# Altium schematic sheet sine_wave_generator.SchDoc
size A4
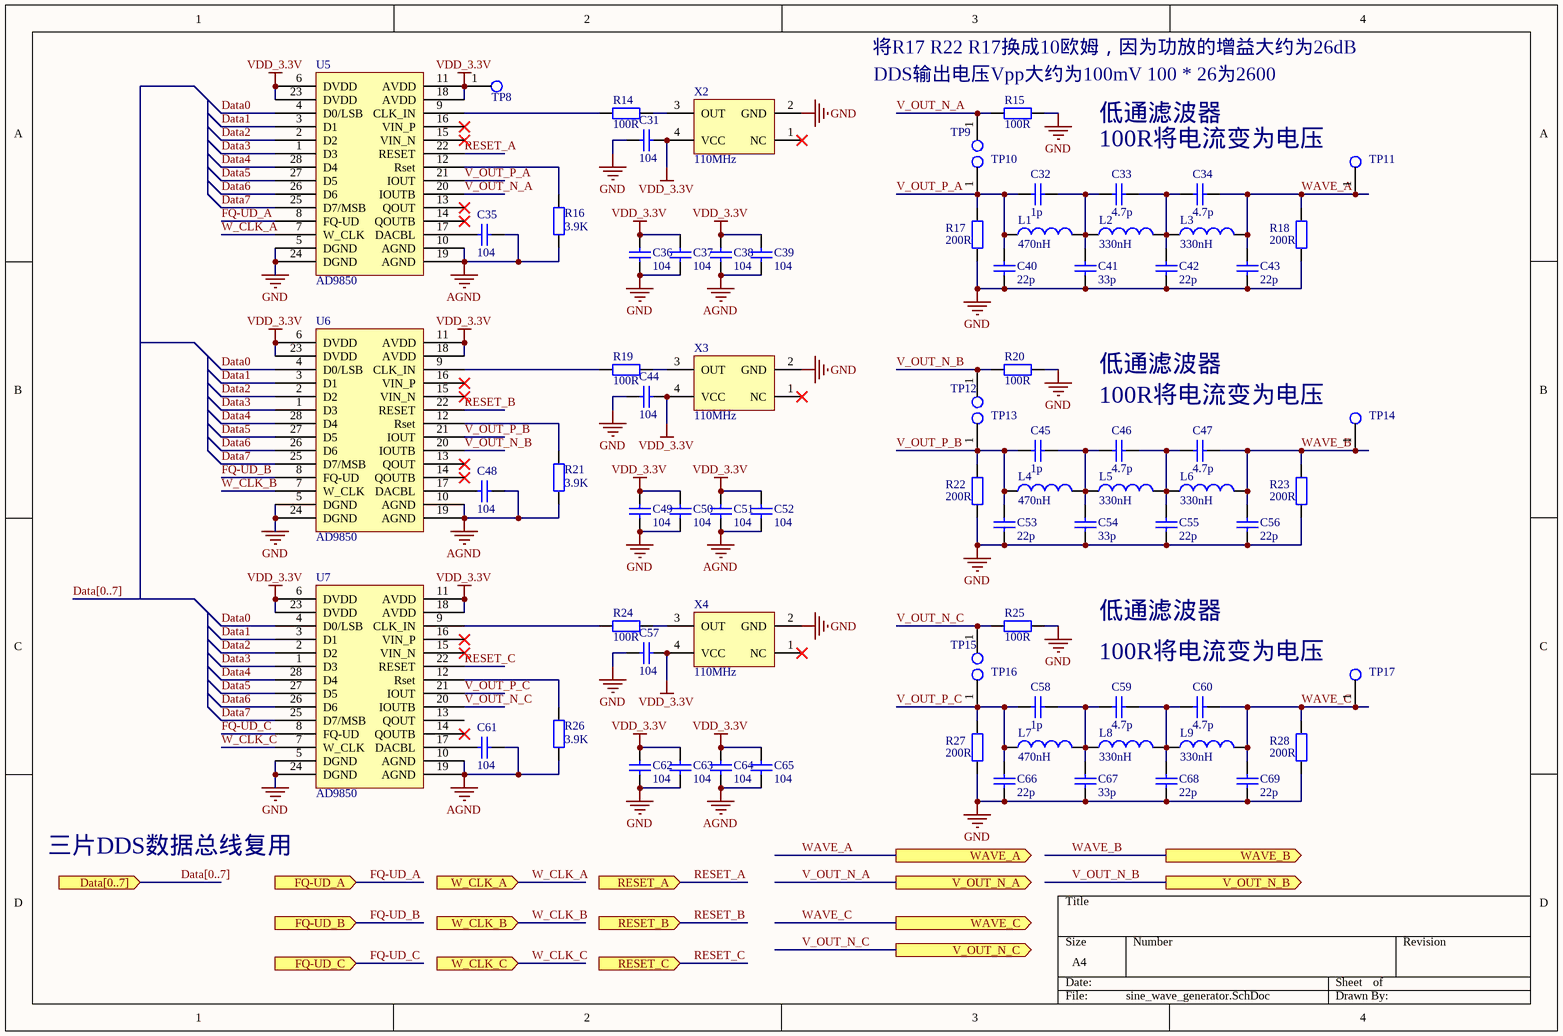
[diagram p0: sine_wave_generator.SchDoc]

## Parts
C31  value 104  [0603]  (hidden comment: Cap)
C32  value 1p  [0603]  (hidden comment: Cap)
C33  value 4.7p  [0603]  (hidden comment: Cap)
C34  value 4.7p  [0603]  (hidden comment: Cap)
C35  value 104  [0603]  (hidden comment: Cap)
C36  value 104  [0603]  (hidden comment: Cap)
C37  value 104  [0603]  (hidden comment: Cap)
C38  value 104  [0603]  (hidden comment: Cap)
C39  value 104  [0603]  (hidden comment: Cap)
C40  value 22p  [0603]  (hidden comment: Cap)
C41  value 33p  [0603]  (hidden comment: Cap)
C42  value 22p  [0603]  (hidden comment: Cap)
C43  value 22p  [0603]  (hidden comment: Cap)
C44  value 104  [0603]  (hidden comment: Cap)
C45  value 1p  [0603]  (hidden comment: Cap)
C46  value 4.7p  [0603]  (hidden comment: Cap)
C47  value 4.7p  [0603]  (hidden comment: Cap)
C48  value 104  [0603]  (hidden comment: Cap)
C49  value 104  [0603]  (hidden comment: Cap)
C50  value 104  [0603]  (hidden comment: Cap)
C51  value 104  [0603]  (hidden comment: Cap)
C52  value 104  [0603]  (hidden comment: Cap)
C53  value 22p  [0603]  (hidden comment: Cap)
C54  value 33p  [0603]  (hidden comment: Cap)
C55  value 22p  [0603]  (hidden comment: Cap)
C56  value 22p  [0603]  (hidden comment: Cap)
C57  value 104  [0603]  (hidden comment: Cap)
C58  value 1p  [0603]  (hidden comment: Cap)
C59  value 4.7p  [0603]  (hidden comment: Cap)
C60  value 4.7p  [0603]  (hidden comment: Cap)
C61  value 104  [0603]  (hidden comment: Cap)
C62  value 104  [0603]  (hidden comment: Cap)
C63  value 104  [0603]  (hidden comment: Cap)
C64  value 104  [0603]  (hidden comment: Cap)
C65  value 104  [0603]  (hidden comment: Cap)
C66  value 22p  [0603]  (hidden comment: Cap)
C67  value 33p  [0603]  (hidden comment: Cap)
C68  value 22p  [0603]  (hidden comment: Cap)
C69  value 22p  [0603]  (hidden comment: Cap)
L1  470nH  [0805L]
L2  330nH  [0805L]
L3  330nH  [0805L]
L4  470nH  [0805L]
L5  330nH  [0805L]
L6  330nH  [0805L]
L7  470nH  [0805L]
L8  330nH  [0805L]
L9  330nH  [0805L]
R14  value 100R  [0603]  (hidden comment: Res)
R15  value 100R  [0603]  (hidden comment: Res)
R16  value 3.9K  [0603]  (hidden comment: Res)
R17  value 200R  [0603]  (hidden comment: Res)
R18  value 200R  [0603]  (hidden comment: Res)
R19  value 100R  [0603]  (hidden comment: Res)
R20  value 100R  [0603]  (hidden comment: Res)
R21  value 3.9K  [0603]  (hidden comment: Res)
R22  value 200R  [0603]  (hidden comment: Res)
R23  value 200R  [0603]  (hidden comment: Res)
R24  value 100R  [0603]  (hidden comment: Res)
R25  value 100R  [0603]  (hidden comment: Res)
R26  value 3.9K  [0603]  (hidden comment: Res)
R27  value 200R  [0603]  (hidden comment: Res)
R28  value 200R  [0603]  (hidden comment: Res)
TP8  testPoint  [TP_H]  (value not drawn)
TP9  testPoint  [TP_H]  (value not drawn)
TP10  testPoint  [TP_H]  (value not drawn)
TP11  testPoint  [TP_H]  (value not drawn)
TP12  testPoint  [TP_H]  (value not drawn)
TP13  testPoint  [TP_H]  (value not drawn)
TP14  testPoint  [TP_H]  (value not drawn)
TP15  testPoint  [TP_H]  (value not drawn)
TP16  testPoint  [TP_H]  (value not drawn)
TP17  testPoint  [TP_H]  (value not drawn)
U5  AD9850  [SOP65P780X198-28N]
U6  AD9850  [SOP65P780X198-28N]
U7  AD9850  [SOP65P780X198-28N]
X2  110MHz  [3225]
X3  110MHz  [3225]
X4  110MHz  [3225]

## Ports
Data[0..7] (in), FQ-UD_A (in), FQ-UD_B (in), FQ-UD_C (in), RESET_A (in), RESET_B (in), RESET_C (in), V_OUT_N_A (out), V_OUT_N_B (out), V_OUT_N_C (out), W_CLK_A (in), W_CLK_B (in), W_CLK_C (in), WAVE_A (out), WAVE_B (out), WAVE_C (out)

## Nets
AGND: C35.2 C38.1 C39.1 C48.2 C51.1 C52.1 C61.1 C64.1 C65.1 R16.1 R21.1 R26.1 U5.10(AGND) U5.19(AGND) U6.10(AGND) U6.19(AGND) U7.10(AGND) U7.19(AGND)
GND: C31.1 C36.1 C37.1 C40.1 C41.1 C42.1 C43.1 C44.1 C49.1 C50.1 C53.1 C54.1 C55.1 C56.1 C57.2 C62.1 C63.1 C66.1 C67.1 C68.1 C69.1 R15.2 R17.1 R18.1 R20.2 R22.1 R23.1 R25.2 R27.1 R28.1 U5.5(DGND) U5.24(DGND) U6.5(DGND) U6.24(DGND) U7.5(DGND) U7.24(DGND) X2.2(GND) X3.2(GND) X4.2(GND)
VDD_3.3V: C31.2 C36.2 C37.2 C38.2 C39.2 C44.2 C49.2 C50.2 C51.2 C52.2 C57.1 C62.2 C63.2 C64.2 C65.2 TP8.1 U5.6(DVDD) U5.11(AVDD) U5.18(AVDD) U5.23(DVDD) U6.6(DVDD) U6.11(AVDD) U6.18(AVDD) U6.23(DVDD) U7.6(DVDD) U7.11(AVDD) U7.18(AVDD) U7.23(DVDD) X2.4(VCC) X3.4(VCC) X4.4(VCC)
Data0: U5.4(D0/LSB) U6.4(D0/LSB) U7.4(D0/LSB)
Data1: U5.3(D1) U6.3(D1) U7.3(D1)
Data2: U5.2(D2) U6.2(D2) U7.2(D2)
Data3: U5.1(D3) U6.1(D3) U7.1(D3)
Data4: U5.28(D4) U6.28(D4) U7.28(D4)
Data5: U5.27(D5) U6.27(D5) U7.27(D5)
Data6: U5.26(D6) U6.26(D6) U7.26(D6)
Data7: U5.25(D7/MSB) U6.25(D7/MSB) U7.25(D7/MSB)
FQ-UD_A: U5.8(FQ-UD) ; port FQ-UD_A
FQ-UD_B: U6.8(FQ-UD) ; port FQ-UD_B
FQ-UD_C: U7.8(FQ-UD) ; port FQ-UD_C
RESET_A: U5.22(RESET) ; port RESET_A
RESET_B: U6.22(RESET) ; port RESET_B
RESET_C: U7.22(RESET) ; port RESET_C
V_OUT_N_A: R15.1 TP9.1 U5.20(IOUTB) ; port V_OUT_N_A
V_OUT_N_B: R20.1 TP12.1 U6.20(IOUTB) ; port V_OUT_N_B
V_OUT_N_C: R25.1 TP15.1 U7.20(IOUTB) ; port V_OUT_N_C
V_OUT_P_A: C32.1 C40.2 L1.1 R17.2 TP10.1 U5.21(IOUT)
V_OUT_P_B: C45.1 C53.2 L4.1 R22.2 TP13.1 U6.21(IOUT)
V_OUT_P_C: C58.1 C66.2 L7.1 R27.2 TP16.1 U7.21(IOUT)
W_CLK_A: U5.7(W_CLK) ; port W_CLK_A
W_CLK_B: U6.7(W_CLK) ; port W_CLK_B
W_CLK_C: U7.7(W_CLK) ; port W_CLK_C
WAVE_A: C34.2 C43.2 L3.2 R18.2 TP11.1 ; port WAVE_A
WAVE_B: C47.2 C56.2 L6.2 R23.2 TP14.1 ; port WAVE_B
WAVE_C: C60.2 C69.2 L9.2 R28.2 TP17.1 ; port WAVE_C
NetC32_2: C32.2 C33.1 C41.2 L1.2 L2.1
NetC33_2: C33.2 C34.1 C42.2 L2.2 L3.1
NetC35_1: C35.1 U5.17(DACBL)
NetC45_2: C45.2 C46.1 C54.2 L4.2 L5.1
NetC46_2: C46.2 C47.1 C55.2 L5.2 L6.1
NetC48_1: C48.1 U6.17(DACBL)
NetC58_2: C58.2 C59.1 C67.2 L7.2 L8.1
NetC59_2: C59.2 C60.1 C68.2 L8.2 L9.1
NetC61_2: C61.2 U7.17(DACBL)
NetR14_1: R14.1 U5.9(CLK_IN)
NetR14_2: R14.2 X2.3(OUT)
NetR16_2: R16.2 U5.12(Rset)
NetR19_1: R19.1 U6.9(CLK_IN)
NetR19_2: R19.2 X3.3(OUT)
NetR21_2: R21.2 U6.12(Rset)
NetR24_1: R24.1 U7.9(CLK_IN)
NetR24_2: R24.2 X4.3(OUT)
NetR26_2: R26.2 U7.12(Rset)

Not connected (* = marked no-connect by the designer): U5 13(QOUT)* 14(QOUTB)* 15(VIN_N)* 16(VIN_P)*; U6 13(QOUT)* 14(QOUTB)* 15(VIN_N)* 16(VIN_P)*; U7 13(QOUT) 14(QOUTB)* 15(VIN_N)* 16(VIN_P)*; X2 1(NC)*; X3 1(NC)*; X4 1(NC)*

## Buses and harness runs
bus Data[0..7]
bus Data[0..7] = port Data[0..7]

## Notes on the sheet
- 将R17 R22 R17换成10欧姆，因为功放的增益大约为26dB
- (near R15) DDS输出电压Vpp大约为100mV 100 * 26为2600
- 低通滤波器
- 100R将电流变为电压
- 三片DDS数据总线复用

## Library data of the parts
C31-C69 = Cap: 原理图绘制者: 刘永钦; 原理图何处使用过: 2014年飞思卡尔底板; 原理图审核人1: 徐鹏飞; 封装0805何处使用: 2015年航行器遥控器; 原理图审核人2: 朱觉文; 封装0603何处使用过: 在2401转接板上使用; Pressure Voltage: 16V; 原理图提供者: 刘永钦; 封装0805绘制者: 刘永钦; 封装0805提供者: 刘永钦; 封装0805审核人1: 徐鹏飞; 封装0805审核人2: 朱觉文; 封装0603绘制者: 刘永钦; 封装0603提供者: 刘永钦; 封装0603审核人1: 朱觉文; 封装0603审核人2: 徐鹏飞
L1-L9 = Inductor
R14-R28 = Res: 原理图绘制者: 刘永钦; 原理图何处使用过: 2014年飞思卡尔底板; 原理图审核人1: 徐鹏飞; 封装0805何处使用过: 2015年航行器遥控器; 原理图审核人2: 朱觉文; 封装2512-RESC6332X06N何处使用过: 在无刷直流电机驱动板上使用过; 封装0603何处使用过: 在2401转接板上使用; 原理图提供者: 刘永钦; 封装0805绘制者: 刘永钦; 封装0805提供者: 刘永钦; 封装0805审核人1: 徐鹏飞; 封装0805审核人2: 朱觉文; 封装0603提供者: 刘永钦; 封装0603审核人2: 朱觉文; 封装0603审核人1: 徐鹏飞; 封装2512-RESC6332X06N审核人2: 朱觉文; 封装2512-RESC6332X06N提供者: 刘永钦; 封装2512-RESC6332X06N审核人1: 徐鹏飞; 封装0603绘制者: 刘永钦; 封装2512-RESC6332X06N绘制者: 刘永钦
TP8-TP17 = TP
X2-X4 = Oscillator